# Altium schematic sheet ESP32.SchDoc
size A4; SheetNumber: 1; SheetTotal: 4
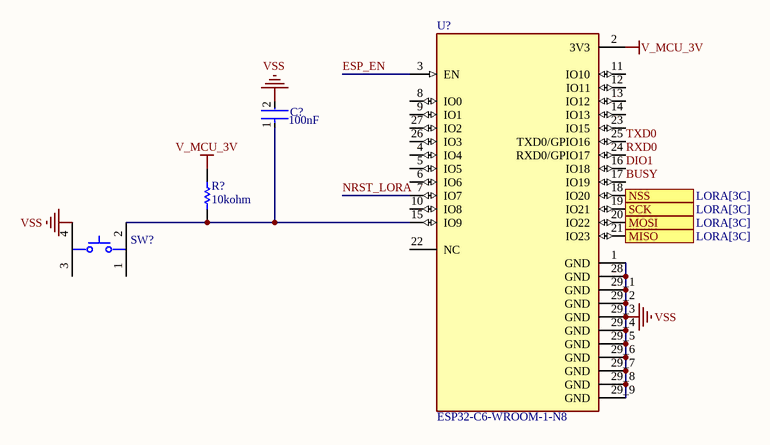
[diagram p0: ESP32.SchDoc]

## Parts
C?  Capacitance: 100nF  [FP-CL21-IPC_B]
R?  Resistance: 10kohm  [RESC2013X60X35ML10T20]  (hidden comment: RC0805JR-0710KL)
SW?  TL3305CF160QG  [FP-TL3305CF160QG-MFG]  (value not drawn)
U?  ESP32-C6-WROOM-1-N8  [XCVR_ESP32-C6-WROOM-1-N8]

## Ports
MISO (out, see LORA[3C]), MOSI (in, see LORA[3C]), NSS (in, see LORA[3C]), SCK (in, see LORA[3C])

## Nets
V_MCU_3V: R?.2 U?.2(3V3)
VSS: C?.2 SW?.4 U?.1(GND) U?.28(GND) U?.29_1(GND) U?.29_2(GND) U?.29_3(GND) U?.29_4(GND) U?.29_5(GND) U?.29_6(GND) U?.29_7(GND) U?.29_8(GND) U?.29_9(GND)
BUSY: U?.17(IO19)
DIO1: U?.16(IO18)
ESP_EN: U?.3(EN)
MISO: U?.21(IO23) ; port MISO
MOSI: U?.20(IO22) ; port MOSI
NRST_LORA: U?.7(IO7)
NSS: U?.18(IO20) ; port NSS
RXD0: U?.24(RXD0/GPIO17)
SCK: U?.19(IO21) ; port SCK
TXD0: U?.25(TXD0/GPIO16)
NetC?_1: C?.1 R?.1 SW?.2 U?.15(IO9)

Not connected (* = marked no-connect by the designer): SW? 1 3; U? 4(IO4) 5(IO5) 6(IO6) 8(IO0) 9(IO1) 10(IO8) 11(IO10) 12(IO11) 13(IO12) 14(IO13) 22(NC) 23(IO15) 26(IO3) 27(IO2)

## Library data of the parts
C? = CMP-13271-004652-1: CL21 Series 0805 100nF 50V ±10% Tolerance X7R Multilayer Ceramic Chip Capacitor; Voltage Rating (DC): 50V; Packaging: Tape and Reel; Voltage Rating: 50V; Max Operating Temperature: 125°C; Width: 0.049inch; Thickness: 0.053inch; Dielectric: X7R; Construction: Flat; Series: CL; Radiation Hardening: No; Mount: Surface Mount; Length: 2mm; Contact Plating: Tin; RoHS Compliant: Yes; Case/Package: 0805; Min Operating Temperature: -55°C; Tolerance: 10%; Lead Free: Lead Free; Height: 1.25mm; Depth: 1.25mm; Package Quantity: 10000
R? = CMP-2000-05025-1: Chip Resistor, 10 KOhm, +/- 5%, 0.125 W, -55 to 155 degC, 0805 (2012 Metric), RoHS, Tape and Reel; Manufacturer: Yageo; Resistor Element Type: ThickFilm; Voltage Rating: 150V; Product Range: RCSeries; SVHC: ToBeAdvised; Resistor Case Style: 0805[2012Metric]; Temperature Coefficient: ±100ppm/degC; Power Rating: 250mW; Automotive Qualification Standard: -; Datasheet Version: REV. 2, 09/2004; Packaging: CutTape; Resistance Tolerance: ±5%; MSL: MSL1-Unlimited; Manufacturer URL: http://www.yageo.com/; Datasheet URL: http://www.yageo.ru/pdf/RC0805.pdf; Package Description: 2-Pin Surface Mounted Device, Body 2 x 1.25 mm; Package Reference: 805
SW? = CMP-17879-000011-1: SWITCH TACTILE SPST-NO 50MA 12V; Actuator Type: Standard; Illumination Type: Non-Illuminated; Mechanical Life: 500000Cycles; Switch Function: Off-Mom; Switch Travel: 0.2mm; Operating Force: 160gf; Throw Configuration: SPST; Lead Free: Lead Free; Packaging: Tape and Reel; Termination: Gull Wing; Max Operating Temperature: 70°C; Min Operating Temperature: -20°C; Mount: Surface Mount
U? = ESP32-C6-WROOM-1-N8: Multiprotocol Modules ESP32-C6 module, Wi-Fi 6 in 2.4 GHz band, Bluetooth 5, Zigbee 3.0 and Thread. ESP34-WROOM Compatible - ENGINEERING SAMPLE; MF: Espressif Systems; SnapEDA_Link: https://www.snapeda.com/parts/ESP32-C6-WROOM-1-N8/Espressif+Systems/view-part/?ref=snap; Package: SMD-28 Espressif Systems; Value: *; MP: ESP32-C6-WROOM-1-N8; Check_prices: https://www.snapeda.com/parts/ESP32-C6-WROOM-1-N8/Espressif+Systems/view-part/?ref=eda